# Altium schematic sheet Interfaces.SchDoc
size A3; SheetNumber: 1; SheetTotal: 1; PageSetup: Record=PageOptions|CenterHorizontal=True|CenterVertical=True|PrintScale=0.97|XCorrection=1.00|YCorrection=1.00|PrintKind=1|BorderSize=5000000|LeftOffset=0|BottomOffset=0|Orientation=2|PaperLength=2970|PaperWidth=2100|Scale=100|PaperSource=7|PrintQuality=600|MediaType=1|DitherType=10|PaperKind=A4|PrintScaleMode=1
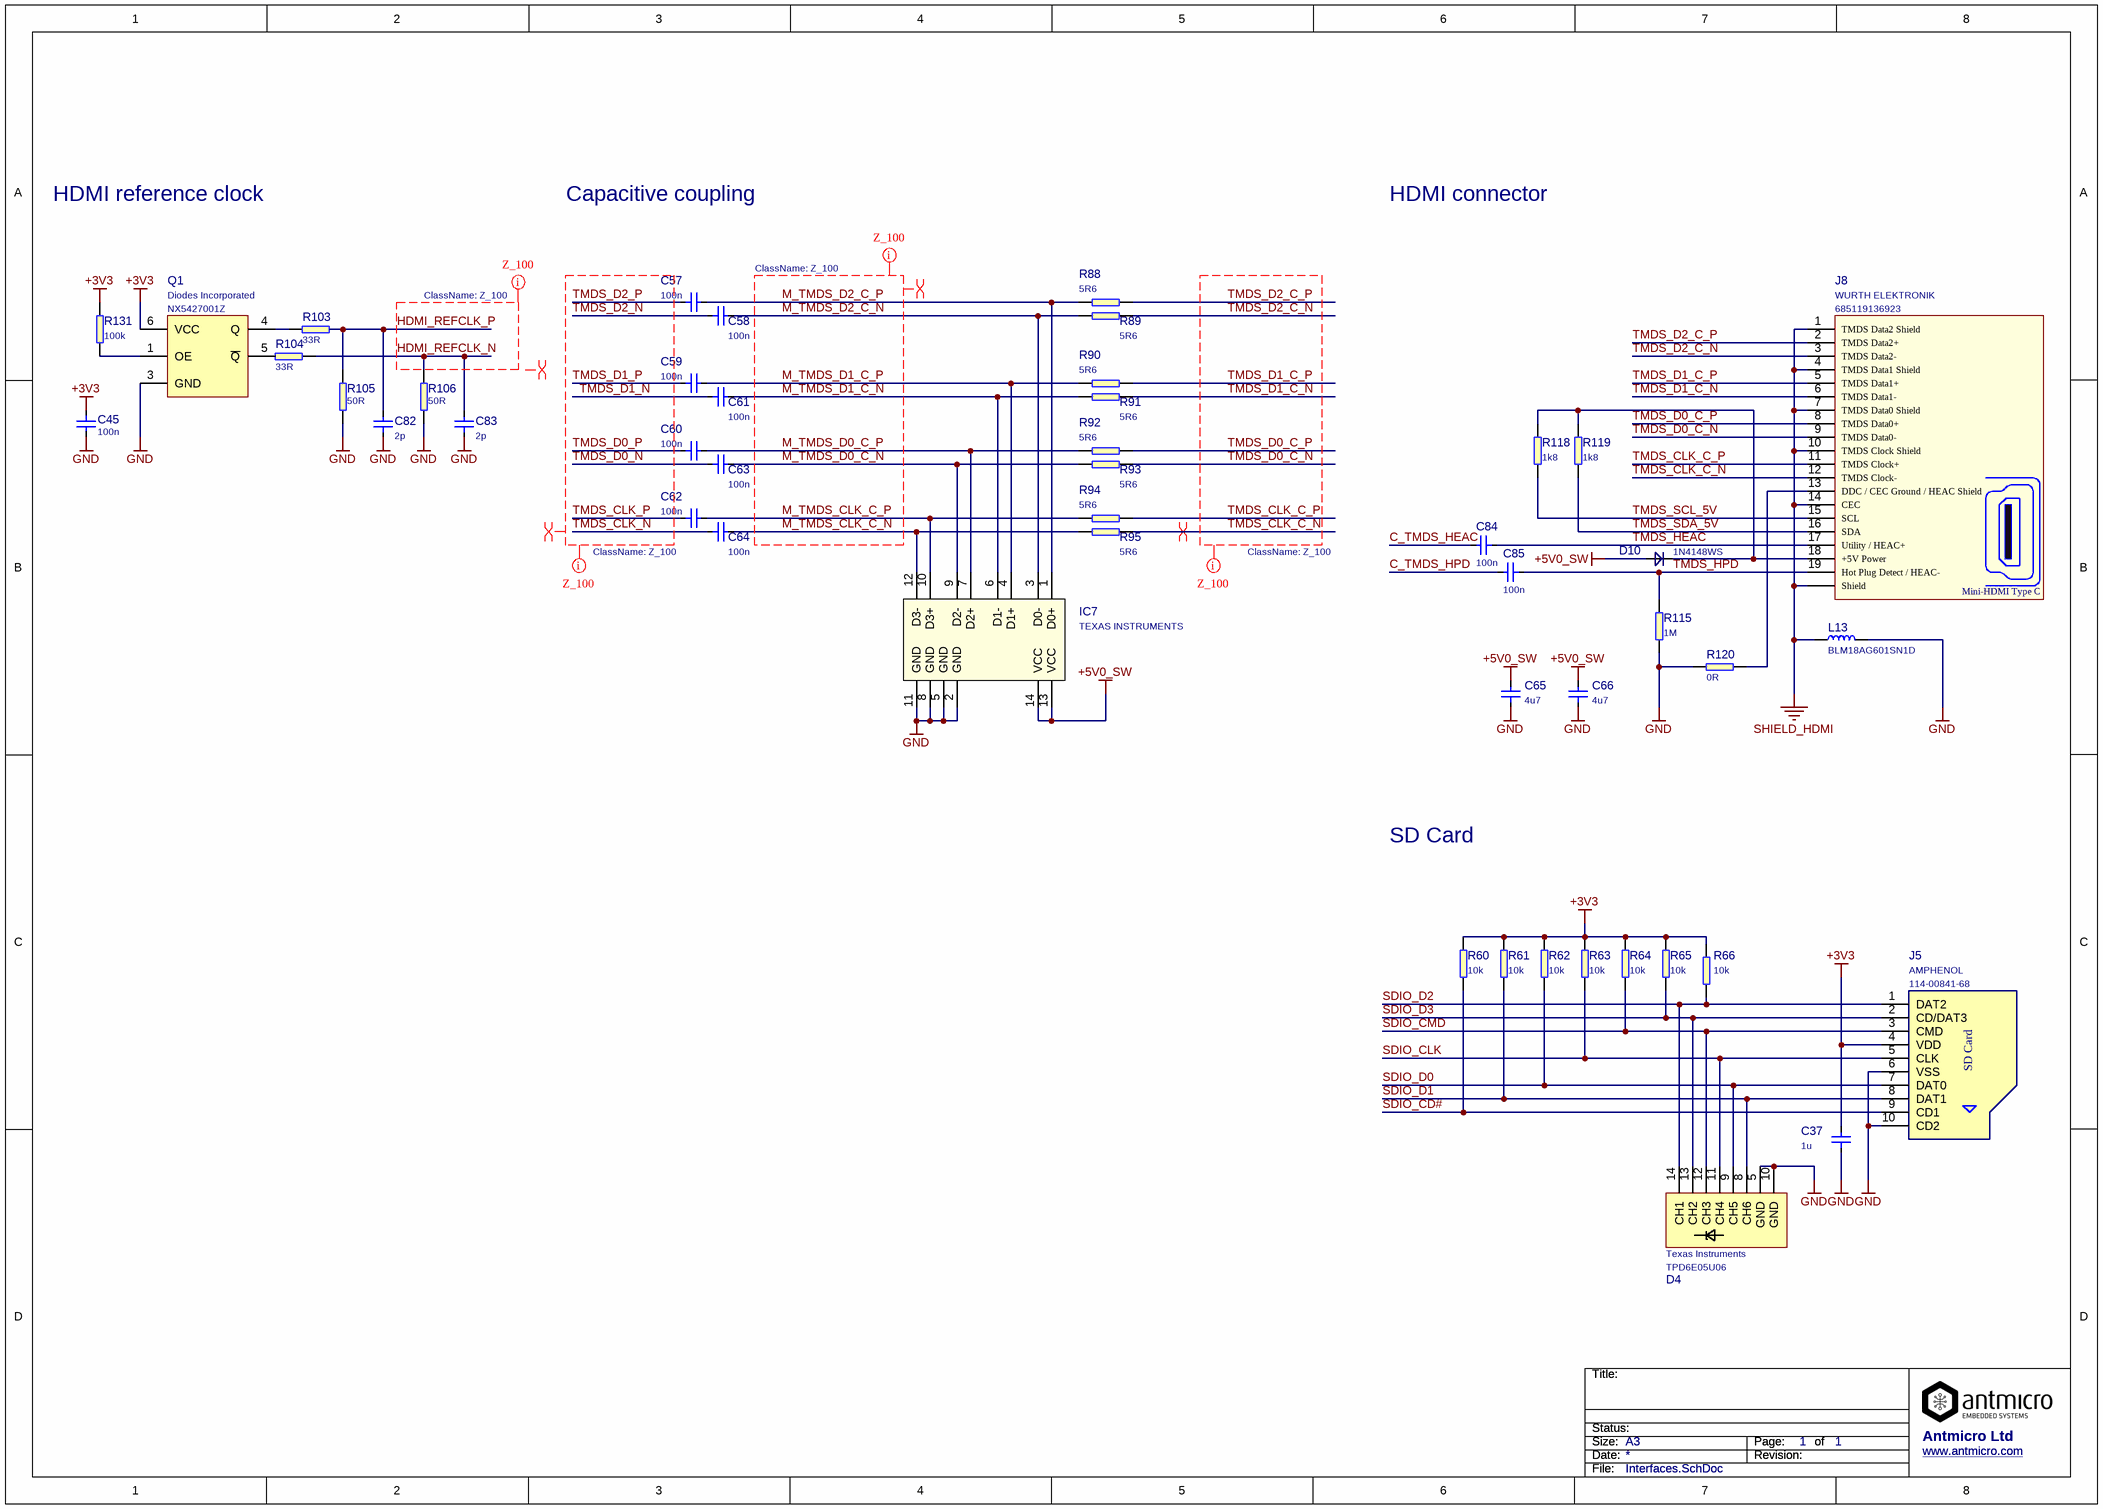
[diagram p0: Interfaces.SchDoc]

## Parts
C37  1u  [0603]
C45  100n  [C_0402]
C57  100n  [C_0402]
C58  100n  [C_0402]
C59  100n  [C_0402]
C60  100n  [C_0402]
C61  100n  [C_0402]
C62  100n  [C_0402]
C63  100n  [C_0402]
C64  100n  [C_0402]
C65  4u7  [C_0402]
C66  4u7  [C_0402]
C82  2p  [C_0402]
C83  2p  [C_0402]
C84  100n  [C_0402]
C85  100n  [C_0402]
D4  Manufacturer: Texas Instruments  [TPD6E05U06_PASS]  (hidden comment: TPD6E05U06)
D10  1N4148WS  [SOD-323]
IC7  Manufacturer: TEXAS INSTRUMENTS  [SON-15]  (hidden comment: TPD8S009)
J5  Manufacturer: AMPHENOL  [114-00841-68]  (hidden comment: 114-00841-68)
J8  685119136923  Manufacturer: WURTH ELEKTRONIK  [WE_685119136923]
L13  BLM18AG601SN1D  [0603]
Q1  Manufacturer: Diodes Incorporated  [NX5427001Z]  (hidden comment: NX5427001Z)
R60  10k  [0402]
R61  10k  [0402]
R62  10k  [0402]
R63  10k  [0402]
R64  10k  [0402]
R65  10k  [0402]
R66  10k  [0402]
R88  5R6  [0402]
R89  5R6  [0402]
R90  5R6  [0402]
R91  5R6  [0402]
R92  5R6  [0402]
R93  5R6  [0402]
R94  5R6  [0402]
R95  5R6  [0402]
R103  33R  [0402]
R104  33R  [0402]
R105  50R  [0402]
R106  50R  [0402]
R115  1M  [0402]
R118  1k8  [0603]
R119  1k8  [0603]
R120  0R  [0402]
R131  100k  [0402]

## Nets
+3V3: C37.2 C45.1 J5.4(VDD) Q1.6(VCC) R60.2 R61.2 R62.2 R63.2 R64.2 R65.2 R66.2 R131.2
+5V0_SW: C65.2 C66.2 D10.A IC7.13(VCC) IC7.14(VCC)
GND: C37.1 C45.2 C65.1 C66.1 C82.1 C83.1 D4.5(GND) D4.10(GND) IC7.2(GND) IC7.5(GND) IC7.8(GND) IC7.11(GND) J5.6(VSS) J5.10(CD2) L13.2 Q1.3(GND) R105.1 R106.1 R115.1 R120.1
SHIELD_HDMI: J8.1(TMDS_Data2_Shield) J8.4(TMDS_Data1_Shield) J8.7(TMDS_Data0_Shield) J8.10(TMDS_Clock_Shield) J8.14(CEC) J8.Shell(Shield) L13.1
C_TMDS_HEAC: C84.2
C_TMDS_HPD: C85.2
HDMI_REFCLK_N: C83.2 R104.2 R106.2
HDMI_REFCLK_P: C82.2 R103.2 R105.2
M_TMDS_CLK_C_N: C64.2 IC7.12(D3-) R95.1
M_TMDS_CLK_C_P: C62.2 IC7.10(D3+) R94.1
M_TMDS_D0_C_N: C63.2 IC7.9(D2-) R93.1
M_TMDS_D0_C_P: C60.2 IC7.7(D2+) R92.1
M_TMDS_D1_C_N: C61.2 IC7.6(D1-) R91.1
M_TMDS_D1_C_P: C59.2 IC7.4(D1+) R90.1
M_TMDS_D2_C_N: C58.2 IC7.3(D0-) R89.1
M_TMDS_D2_C_P: C57.2 IC7.1(D0+) R88.1
SDIO_CD#: J5.9(CD1) R60.1
SDIO_CLK: D4.11(CH4) J5.5(CLK) R63.1
SDIO_CMD: D4.12(CH3) J5.3(CMD) R64.1
SDIO_D0: D4.9(CH5) J5.7(DAT0) R62.1
SDIO_D1: D4.8(CH6) J5.8(DAT1) R61.1
SDIO_D2: D4.14(CH1) J5.1(DAT2) R66.1
SDIO_D3: D4.13(CH2) J5.2(CD/DAT3) R65.1
TMDS_CLK_C_N: J8.12(TMDS_Clock-) R95.2
TMDS_CLK_C_P: J8.11(TMDS_Clock+) R94.2
TMDS_CLK_N: C64.1
TMDS_CLK_P: C62.1
TMDS_D0_C_N: J8.9(TMDS_Data0-) R93.2
TMDS_D0_C_P: J8.8(TMDS_Data0+) R92.2
TMDS_D0_N: C63.1
TMDS_D0_P: C60.1
TMDS_D1_C_N: J8.6(TMDS_Data1-) R91.2
TMDS_D1_C_P: J8.5(TMDS_Data1+) R90.2
TMDS_D1_N: C61.1
TMDS_D1_P: C59.1
TMDS_D2_C_N: J8.3(TMDS_Data2-) R89.2
TMDS_D2_C_P: J8.2(TMDS_Data2+) R88.2
TMDS_D2_N: C58.1
TMDS_D2_P: C57.1
TMDS_HEAC: C84.1 J8.17(Utility_/_HEAC+)
TMDS_HPD: C85.1 J8.19(Hot_Plug_Detect_/_HEAC-) R115.2
TMDS_SCL_5V: J8.15(SCL) R118.1
TMDS_SDA_5V: J8.16(SDA) R119.1
NetD10_C: D10.C J8.18(+5V_Power) R118.2 R119.2
NetJ8_13: J8.13(DDC_/_CEC_Ground_/_HEAC_Shield) R120.2
NetQ1_1: Q1.1(OE) R131.1
NetQ1_4: Q1.4(Q) R103.1
NetQ1_5: Q1.5(~{Q}) R104.1

## Layout directives
net class Z_100: HDMI_REFCLK_N, HDMI_REFCLK_P, M_TMDS_CLK_C_N, M_TMDS_CLK_C_P, M_TMDS_D0_C_N, M_TMDS_D0_C_P, M_TMDS_D1_C_N, M_TMDS_D1_C_P, M_TMDS_D2_C_N, M_TMDS_D2_C_P, TMDS_CLK_C_N, TMDS_CLK_C_P, TMDS_CLK_N, TMDS_CLK_P, TMDS_D0_C_N, TMDS_D0_C_P, TMDS_D0_N, TMDS_D0_P, TMDS_D1_C_N, TMDS_D1_C_P, TMDS_D1_N, TMDS_D1_P, TMDS_D2_C_N, TMDS_D2_C_P, TMDS_D2_N, TMDS_D2_P
differential pair: (no net found under the mark), M_TMDS_CLK_C_N, M_TMDS_CLK_C_P, M_TMDS_D0_C_N, M_TMDS_D0_C_P, M_TMDS_D1_C_N, M_TMDS_D1_C_P, M_TMDS_D2_C_N, M_TMDS_D2_C_P, TMDS_CLK_C_N, TMDS_CLK_N, TMDS_CLK_P, TMDS_D0_N, TMDS_D0_P, TMDS_D1_N, TMDS_D1_P, TMDS_D2_N, TMDS_D2_P

## Notes on the sheet
- HDMI reference clock
- Capacitive coupling
- HDMI connector
- SD Card
- Title:
- Size:
- Date:
- Status:
- A3
- Revision:
- Page:
- of
- Antmicro Ltd
- www.antmicro.com
- File:
- (in symbol AMP-114-00841-68) SD Card
- (in symbol WE_685119136923) Mini-HDMI Type C

## Library data of the parts
C37 = C_1u_0603: MLCC SMT Capacitor 1uF 0603; Value: 1u; PartNumber: C_1u_0603
C45 C57-C64 C84 C85 = C_100n_0402: MLCC SMT Capacitor 100nF 0402; PartNumber: C_100n_0402; Value: 100n
C65 C66 = C_4u7_0402: MLCC SMT Capacitor 4u7F 0402; PartNumber: C_4u7_0402; Value: 4u7
C82 C83 = C_2p_0402: MLCC SMT Capacitor 2p 0402; PartNumber: C_2p_0402; Value: 2p
D4 = TPD6E05U06_PASS: ESD Suppressors 6-CH Pass through layout; Value: TPD6E05U06; PartNumber: TPD6E05U06
D10 = 1N4148WS: Diode small signal; Manufacturer: MULTICOMP; Value: 1N4148WS; PartNumber: 1N4148WS
IC7 = TPD8S009: 8-Channel ESD Protection for DisplayPort and HDMI; PartNumber: TPD8S009; Value: TPD8S009
J5 = AMP-114-00841-68: Micro SD card holder; Value: 114-00841-68; PartNumber: 114-00841-68
J8 = WE_685119136923: CONN HDMI FEMALE R/A 19POS 2.6MM; PartNumber: WE_685119136923; Value: 685119136923
L13 = BLM18AG601SN1D: Ferrite Bead, 600 ohm, 0603 [1608 Metric], BLM18A Series, 500 mA, 0.38 ohm, ? 25%; Manufacturer: MURATA; PartNumber: BLM18AG601SN1D; Value: BLM18AG601SN1D
Q1 = NX5427001Z: CLOCK SAW OSCILLATOR SEAM5032; PartNumber: NX5427001Z; Value: NX5427001Z
R60-R66 = R_10k_0402: SMT Resistor 0402; Value: 10k; PartNumber: R_10k_0402
R88-R95 = R_5R6_0402: SMD Resistor 0402; PartNumber: R_5R6_0402; Value: 5R6
R103 R104 = R_33R_0402: RES, 33R, 0402, 1%; PartNumber: R_33R_0402; Value: 33R
R105 R106 = R_33R_0402: RES, 33R, 0402, 1%; PartNumber: R_50R_0402; Value: 50R
R115 = R_1M_0402: SMT Resistor 1M 0402; PartNumber: R_1M_0402; Value: 1M
R118 R119 = R_1k8_0603: SMT Resistor 1k8 0603; PartNumber: R_1k8_0603; Value: 1k8
R120 = R_0R_0402: SMT Resistor 0402; PartNumber: R_0R_0402; Value: 0R
R131 = R_100k_0402: SMT Resistor 100k 0402; PartNumber: R_100k_0402; Value: 100k